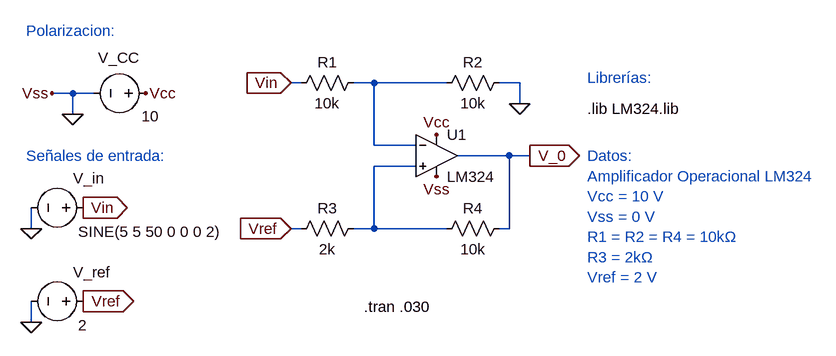
[diagram p0: schematic Lab_1_Circ_4_Vss=0+Vcc=10+Vin=seno.asc]
Lab_1_Circ_4_Vss=0+Vcc=10+Vin=seno.asc, the LTspice schematic file:
Version 4
SHEET 1 1560 680
WIRE 672 -288 656 -288
WIRE 784 -288 752 -288
WIRE 896 -288 784 -288
WIRE 1008 -288 976 -288
WIRE 320 -272 288 -272
WIRE 352 -272 320 -272
WIRE 1008 -256 1008 -288
WIRE 320 -240 320 -272
WIRE 784 -192 784 -288
WIRE 848 -192 784 -192
WIRE 992 -176 912 -176
WIRE 1024 -176 992 -176
WIRE 848 -160 784 -160
WIRE 256 -64 256 -96
WIRE 672 -64 656 -64
WIRE 784 -64 784 -160
WIRE 784 -64 752 -64
WIRE 896 -64 784 -64
WIRE 992 -64 992 -176
WIRE 992 -64 976 -64
WIRE 256 80 256 48
FLAG 1008 -256 0
FLAG 432 -272 Vcc
FLAG 880 -208 Vcc
FLAG 288 -272 Vss
FLAG 880 -144 Vss
FLAG 320 -240 0
FLAG 256 -64 0
FLAG 656 -64 Vref
IOPIN 656 -64 In
FLAG 336 -96 Vin
IOPIN 336 -96 Out
FLAG 1024 -176 V_0
IOPIN 1024 -176 Out
FLAG 656 -288 Vin
IOPIN 656 -288 In
FLAG 256 80 0
FLAG 336 48 Vref
IOPIN 336 48 Out
SYMBOL OpAmps\\opamp2 880 -240 R0
SYMATTR InstName U1
SYMATTR Value LM324
SYMBOL res 656 -272 R270
WINDOW 0 32 56 VTop 2
WINDOW 3 0 56 VBottom 2
SYMATTR InstName R1
SYMATTR Value 10k
SYMBOL res 880 -272 R270
WINDOW 0 32 56 VTop 2
WINDOW 3 0 56 VBottom 2
SYMATTR InstName R2
SYMATTR Value 10k
SYMBOL res 656 -48 R270
WINDOW 0 32 56 VTop 2
WINDOW 3 0 56 VBottom 2
SYMATTR InstName R3
SYMATTR Value 2k
SYMBOL res 880 -48 R270
WINDOW 0 32 56 VTop 2
WINDOW 3 0 56 VBottom 2
SYMATTR InstName R4
SYMATTR Value 10k
SYMBOL voltage 352 -96 M270
WINDOW 0 45 31 VLeft 2
WINDOW 3 -37 24 VLeft 2
WINDOW 123 0 0 Left 0
WINDOW 39 0 0 Left 0
SYMATTR InstName V_in
SYMATTR Value SINE(5 5 50 0 0 0 2)
SYMBOL voltage 448 -272 R90
WINDOW 0 -55 25 VRight 2
WINDOW 3 35 -5 VRight 2
WINDOW 123 0 0 Left 0
WINDOW 39 0 0 Left 0
SYMATTR InstName V_CC
SYMATTR Value 10
SYMBOL voltage 352 48 M270
WINDOW 0 45 31 VLeft 2
WINDOW 3 -37 24 VLeft 2
WINDOW 123 0 0 Left 0
WINDOW 39 0 0 Left 0
SYMATTR InstName V_ref
SYMATTR Value 2
TEXT 1112 -248 Left 2 !.lib LM324.lib
TEXT 1112 -296 Left 2 ;Librerías:
TEXT 248 -368 Left 2 ;Polarizacion:
TEXT 248 -176 Left 2 ;Señales de entrada:
TEXT 1112 -176 Left 2 ;Datos:\nAmplificador Operacional LM324\nVcc = 10 V\nVss = 0 V\nR1 = R2 = R4 = 10kΩ\nR3 = 2kΩ\nVref = 2 V
TEXT 768 56 Left 2 !.tran .030

The netlist it stands for:
* Lab_1_Circ_4_Vss=0+Vcc=10+Vin=seno.asc
XU1 N002 N001 Vcc 0 V_0 LM324  ; pins In+ In- V+ V- OUT
R1 Vin N001 10k
R2 N001 0 10k
R3 Vref N002 2k
R4 N002 V_0 10k
V_in Vin 0 SINE(5 5 50 0 0 0 2)
V_CC Vcc 0 10
V_ref Vref 0 2
.lib LM324.lib
* Librerías:
* Polarizacion:
* Señales de entrada:
* Datos:
* Amplificador Operacional LM324
* Vcc = 10 V
* Vss = 0 V
* R1 = R2 = R4 = 10kΩ
* R3 = 2kΩ
* Vref = 2 V
.tran .030
.backanno
.end